# EAGLE board MGBC-MBL-01_2_1 (EAGLE 9.6.2)
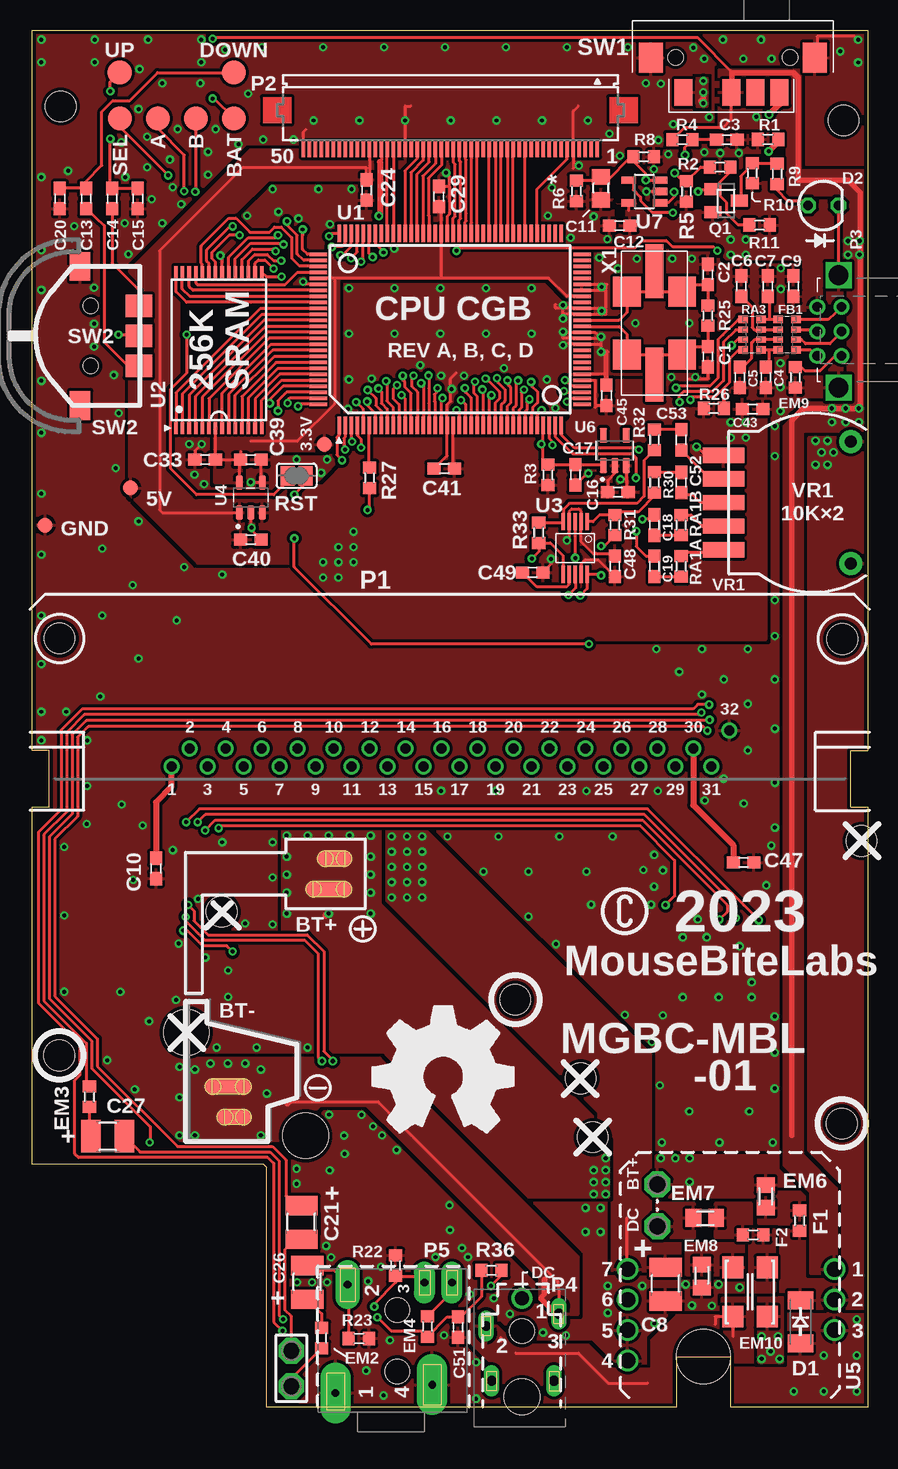
[diagram p1: board, top side]
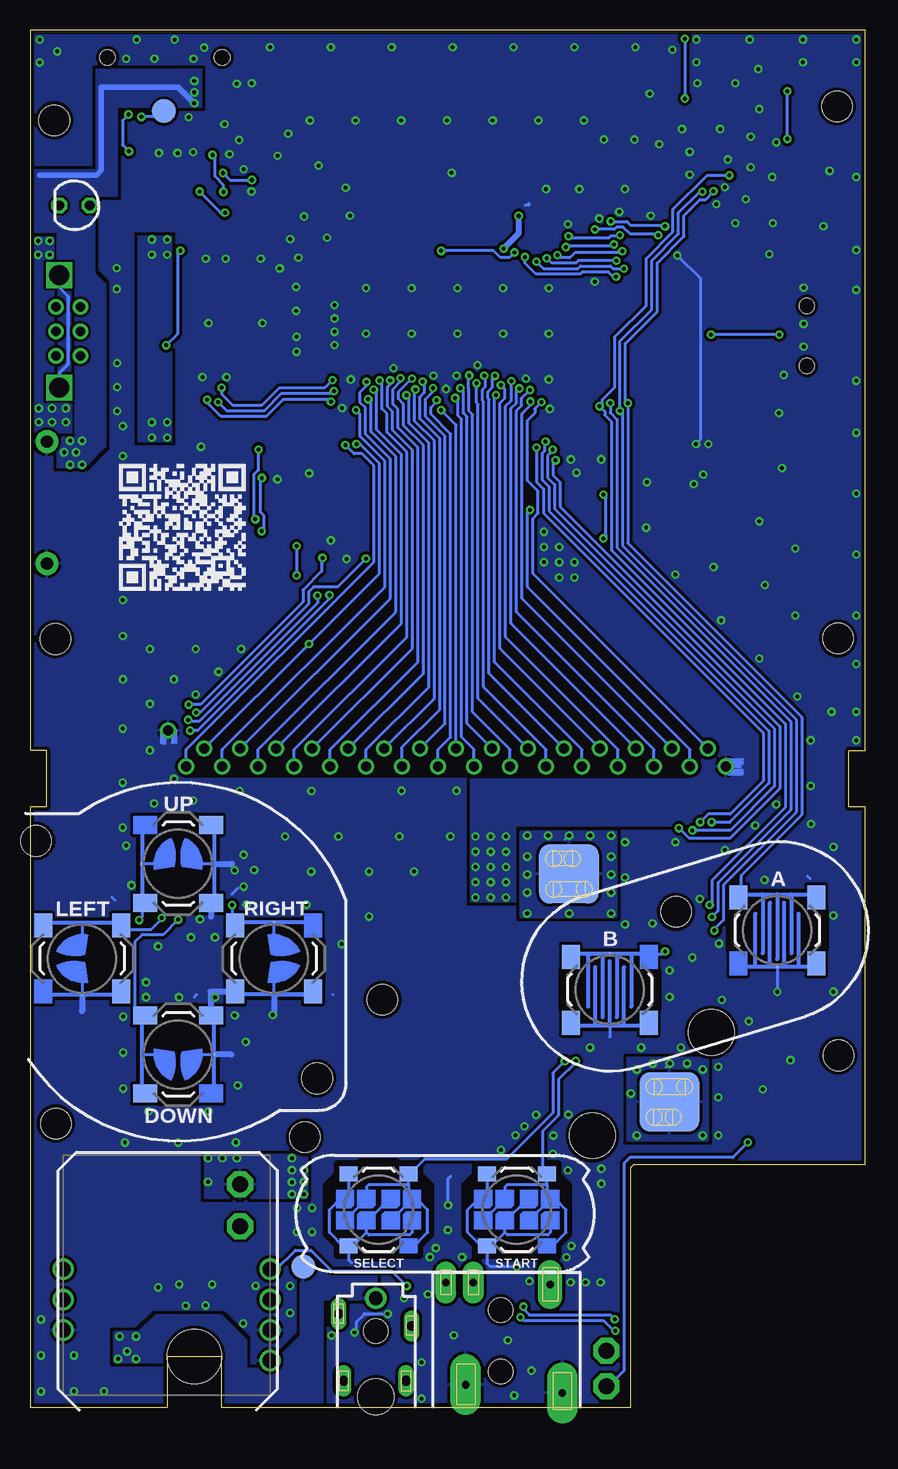
[diagram p2: board, bottom side, seen from below]

Size 69.65 x 114.8 mm. Coordinates in mm from the lower left corner, seen from the top.
Outline: 0,54.75 0,114.8 69.65,114.8 69.65,54.73 68.24,54.73 68.24,50.03 69.65,50.03 69.65,0 58.2,0 58.2,4.19 53.7,4.19 53.7,0 19.55,0 19.55,20 19.3,20.25 0,20.25 0,50.05 1.4,50.05 1.4,54.75 0,54.75
Copper layers (1*16): Top 0.0356mm / dielectric 1.5011mm / Bottom 0.0356mm
Design rules "jlcpcb *": minimum track width 10mil, minimum drill 13mil, track to track 8mil, track to pad 8mil, pad to pad 7mil, via to via 8mil, smd to smd 5mil, copper to edge 12mil, drill to drill 22mil, minimum pad ring 10mil, minimum via ring 7mil, stop-mask expansion 2.5mil, vias tented up to drill 14mil, thermal gap 10mil
Holes 2.54 mm at 2.36,108.43 67.63,107.27 2.27,64.08 67.54,64.03 2.24,29.33 67.5,23.64 40.27,33.97 45.71,27.4 46.73,22.5 15.79,41.29 69.14,47.19
Holes 3.81 mm at 12.84,31.23 22.77,22.63
Holes 4.5 mm at 55.95,4.22
tRestrict: area 24.6,-0.8 to 27.7,-0.1; area 45.5,88.8 to 46.2,91.6; area 22.5,14.3 to 23.7,16.2; area 23.8,-1.8 to 35.8,-0.1; area 46.7,21.5 to 48,22.4; area 55.4,100.2 to 57.1,100.8; area 48.9,99.5 to 49.1,99.9; area 48.9,100.7 to 49.8,101
bRestrict: area 24.6,-0.8 to 27.7,-0.1; area 32.8,52.9 to 56.3,53.8; area 23.8,-1.8 to 35.8,0; area 3.7,42.8 to 4,43.2; area 17.4,31.2 to 18.3,32.2; area 45.5,33.8 to 46.4,34.9; area 53.7,48.3 to 54.8,49.2; area 45.4,33.8 to 45.6,35.8

## Footprints (pad centres in the part's own frame; a part is rotated, then mirrored left to right if it is on the bottom)
B1,27 = smd 1.27 x 1.27: TP 0,0
MGB+BATTERY4 = smd 4.953 x 4.953 bottom: P$1 0.5,0 | smd 2.959 x 1.397: P$2 0.997,1.27 | smd 3.937 x 1.397: P$3 0.514,-1.27
MGB-BATTERY4 = smd 4.953 x 4.953 bottom: P$1 0.25,0.117 | smd 2.959 x 1.397: P$3 0.743,-1.143 | smd 3.937 x 1.397: P$4 0.26,1.397
DMG_BTN3 = smd 1.5 x 2: P$1 -3.25,2.75; P$3 3.25,2.75; P$4 3.25,-2.75 | smd 0.25 x 0.25: P$2 0,-3
TP20R = smd 2 x 2: TP 0,0
P1-13 = drill 1.321 pad 2.159 octagon: TP 0,0
C0603 = smd 1.1 x 1: 1 -0.85,0; 2 0.85,0
C1210 = smd 1.6 x 2.7: 1 -1.4,0; 2 1.4,0
C0805 = smd 1.3 x 1.5: 1 -0.95,0; 2 0.95,0
SOD-123_MINI-SMA = smd 1.5 x 2.1: A 1.8,0; C -1.8,0
LED3MM = drill 0.813 octagon: A -1.27,0; K 1.27,0
MGB_BTN1_2 = smd 1.5 x 2: P$1 -3.25,2.75; P$3 3.25,2.75; P$4 3.25,-2.75 | smd 0.25 x 0.25: P$2 0,-3
R0603 = smd 1 x 1.1: 1 -0.85,0; 2 0.85,0
R0805 = smd 1.3 x 1.5: 1 -0.95,0; 2 0.95,0
ACM4532 = smd 1.8 x 1.75: 1 -2.05,1.425; 2 -2.05,-1.425; 3 2.05,-1.425; 4 2.05,1.425
EXB38V = smd 0.6 x 0.8: 1 -1.275,-0.75; 4 1.275,-0.75; 5 1.275,0.75; 8 -1.275,0.75 | smd 0.5 x 0.8: 2 -0.4,-0.75; 3 0.4,-0.75; 6 0.4,0.75; 7 -0.4,0.75
MGB-CART = drill 0.83: 1 0,0; 2 1.5,1.5; 3 3,0; 4 4.5,1.5; 5 6,0; 6 7.5,1.5; 7 9,0; 8 10.5,1.5; 9 12,0; 10 13.5,1.5; 11 15,0; 12 16.5,1.5; 13 18,0; 14 19.5,1.5; 15 21,0; 16 22.5,1.5; 17 24,0; 18 25.5,1.5; 19 27,0; 20 28.5,1.5; 21 30,0; 22 31.5,1.5; 23 33,0; 24 34.5,1.5; 25 36,0; 26 37.5,1.5; 27 39,0; 28 40.5,1.5; 29 42,0; 30 43.5,1.5; 31 45,0; 32 46.5,3
62684-502100AHLF = smd 0.3 x 1.3: 1 -12.25,3.25; 2 -11.75,3.25; 3 -11.25,3.25; 4 -10.75,3.25; 5 -10.25,3.25; 6 -9.75,3.25; 7 -9.25,3.25; 8 -8.75,3.25; 9 -8.25,3.25; 10 -7.75,3.25; 11 -7.25,3.25; 12 -6.75,3.25; 13 -6.25,3.25; 14 -5.75,3.25; 15 -5.25,3.25; 16 -4.75,3.25; 17 -4.25,3.25; 18 -3.75,3.25; 19 -3.25,3.25; 20 -2.75,3.25; 21 -2.25,3.25; 22 -1.75,3.25; 23 -1.25,3.25; 24 -0.75,3.25; 25 -0.25,3.25; 26 0.25,3.25; 27 0.75,3.25; 28 1.25,3.25; 29 1.75,3.25; 30 2.25,3.25; 31 2.75,3.25; 32 3.25,3.25; 33 3.75,3.25; 34 4.25,3.25; 35 4.75,3.25; 36 5.25,3.25; 37 5.75,3.25; 38 6.25,3.25; 39 6.75,3.25; 40 7.25,3.25; 41 7.75,3.25; 42 8.25,3.25; 43 8.75,3.25; 44 9.25,3.25; 45 9.75,3.25; 46 10.25,3.25; 47 10.75,3.25; 48 11.25,3.25; 49 11.75,3.25; 50 12.25,3.25
CGB-LINK = drill 0.8: +5V 1.909,2.032; CLK -2.159,2.032; GND -2.159,0; IN -0.125,2.032; OUT 1.909,0; SD -0.125,0 | drill 1.651 pad 1.905 square: P$7 -4.822,0.254; P$10 4.572,0.254
MGB-PWRJACK = drill 1.143 pad 1.778: 1 -3.629,-2.005 | drill 0.8 pad 1.3 long: 2 -6.604,-4.314; 3 -0.539,-3.302; 4 -6.15,-8.89; 5 -0.953,-8.89 | hole 3: -3.619,-10.222 | hole 2.032: -3.619,-4.753
MGB-HEADPHONE = drill 0.635 pad 2.54 long: GND -4.644,-4.246; SWGND 3.425,-3.556 | drill 0.635 pad 2.032 long: L -3.623,4.779 | drill 0.635 pad 1.75 long: R 2.79,4.949; SW 5.08,4.949 | hole 2.032: 0.508,2.676; 0.508,-2.442
SOT23 = smd 1 x 1.4: 1 -0.95,-1.1; 2 0.95,-1.1; 3 0,1.1
SJ = smd 1.168 x 1.6: 1 -0.762,0; 2 0.762,0
DMG_BTN1_W2 = smd 1.25 x 1.5: P$1 -3,2.5; P$3 3,2.5; P$4 3,-2.5 | smd 0.05 x 0.05: P$2 0,-4.07
MGB-SWITCH = smd 1.5 x 2.2: P$1 -3.75,-2.141; P$2 2.25,-2.141; P$3 4.25,-2.141; P$C 0.25,-2.141 | smd 2 x 2.5: P$MP1 -6.48,0.759; P$MP2 7.22,0.759 | hole 1.3: -4.4,0.759; 5.15,0.759
NAV_SWITCH = smd 1.9 x 2.2: 1 -2.5,-4; 2 2.5,-4; T 0,-4 | smd 2.4 x 1.7: C 5.8,0.9; NC -5.8,0.9 | hole 1.25: -2.5,0; 2.5,0
QFP-128 = smd 0.3 x 1.45: 1 -8.25,-4.5; 2 -7.75,-4.5; 3 -7.25,-4.5; 4 -6.75,-4.5; 5 -6.25,-4.5; 6 -5.75,-4.5; 7 -5.25,-4.5; 8 -4.75,-4.5; 9 -4.25,-4.5; 10 -3.75,-4.5; 11 -3.25,-4.5; 12 -2.75,-4.5; 13 -2.25,-4.5; 14 -1.75,-4.5; 15 -1.25,-4.5; 16 -0.75,-4.5; 17 -0.25,-4.5; 18 0.25,-4.5; 19 0.75,-4.5; 20 1.25,-4.5; 21 1.75,-4.5; 22 2.25,-4.5; 23 2.75,-4.5; 24 3.25,-4.5; 25 3.75,-4.5; 26 4.25,-4.5; 27 4.75,-4.5; 28 5.25,-4.5; 29 5.75,-4.5; 30 6.25,-4.5; 31 6.75,-4.5; 32 7.25,-4.5; 33 7.75,-4.5; 34 8.25,-4.5; 35 8.75,-4.5; 36 9.25,-4.5; 37 9.75,-4.5; 38 10.25,-4.5; 65 10.25,11.5; 66 9.75,11.5; 67 9.25,11.5; 68 8.75,11.5; 69 8.25,11.5; 70 7.75,11.5; 71 7.25,11.5; 72 6.75,11.5; 73 6.25,11.5; 74 5.75,11.5; 75 5.25,11.5; 76 4.75,11.5; 77 4.25,11.5; 78 3.75,11.5; 79 3.25,11.5; 80 2.75,11.5; 81 2.25,11.5; 82 1.75,11.5; 83 1.25,11.5; 84 0.75,11.5; 85 0.25,11.5; 86 -0.25,11.5; 87 -0.75,11.5; 88 -1.25,11.5; 89 -1.75,11.5; 90 -2.25,11.5; 91 -2.75,11.5; 92 -3.25,11.5; 93 -3.75,11.5; 94 -4.25,11.5; 95 -4.75,11.5; 96 -5.25,11.5; 97 -5.75,11.5; 98 -6.25,11.5; 99 -6.75,11.5; 100 -7.25,11.5; 101 -7.75,11.5; 102 -8.25,11.5 | smd 1.45 x 0.3: 39 12,-2.75; 40 12,-2.25; 41 12,-1.75; 42 12,-1.25; 43 12,-0.75; 44 12,-0.25; 45 12,0.25; 46 12,0.75; 47 12,1.25; 48 12,1.75; 49 12,2.25; 50 12,2.75; 51 12,3.25; 52 12,3.75; 53 12,4.25; 54 12,4.75; 55 12,5.25; 56 12,5.75; 57 12,6.25; 58 12,6.75; 59 12,7.25; 60 12,7.75; 61 12,8.25; 62 12,8.75; 63 12,9.25; 64 12,9.75; 103 -10,9.75; 104 -10,9.25; 105 -10,8.75; 106 -10,8.25; 107 -10,7.75; 108 -10,7.25; 109 -10,6.75; 110 -10,6.25; 111 -10,5.75; 112 -10,5.25; 113 -10,4.75; 114 -10,4.25; 115 -10,3.75; 116 -10,3.25; 117 -10,2.75; 118 -10,2.25; 119 -10,1.75; 120 -10,1.25; 121 -10,0.75; 122 -10,0.25; 123 -10,-0.25; 124 -10,-0.75; 125 -10,-1.25; 126 -10,-1.75; 127 -10,-2.25; 128 -10,-2.75
TSOP1-28 = smd 1 x 0.3: 1 -6.5,3.575; 2 -6.5,3.025; 3 -6.5,2.475; 4 -6.5,1.925; 5 -6.5,1.375; 6 -6.5,0.825; 7 -6.5,0.275; 8 -6.5,-0.275; 9 -6.5,-0.825; 10 -6.5,-1.375; 11 -6.5,-1.925; 12 -6.5,-2.475; 13 -6.5,-3.025; 14 -6.5,-3.575; 15 6.5,-3.575; 16 6.5,-3.025; 17 6.5,-2.475; 18 6.5,-1.925; 19 6.5,-1.375; 20 6.5,-0.825; 21 6.5,-0.275; 22 6.5,0.275; 23 6.5,0.825; 24 6.5,1.375; 25 6.5,1.925; 26 6.5,2.475; 27 6.5,3.025; 28 6.5,3.575
VSSOP10 = smd 1.45 x 0.3: 1 -2.2,0.985; 2 -2.2,0.485; 3 -2.2,-0.015; 4 -2.2,-0.515; 5 -2.2,-1.015; 6 2.2,-1.015; 7 2.2,-0.515; 8 2.2,-0.015; 9 2.2,0.485; 10 2.2,0.985
SOT95P280X145-5N = smd 1.21 x 0.59: 1 -1.255,0.95; 2 -1.255,0; 3 -1.255,-0.95; 4 1.255,-0.95; 5 1.255,0.95
MGB-PWRBD = drill 1.27: 1 -0.25,10.5; 2 -0.25,7.96; 3 -0.25,5.42; 4 17,2.88; 5 17,5.42; 6 17,7.96; 7 17,10.5
SOT-23-5 = smd 1.21 x 0.59: 1 -1.255,0.95; 2 -1.255,0; 3 -1.255,-0.95; 4 1.255,-0.95; 5 1.255,0.95
DBV-R-PDSO-G5 = smd 0.6 x 1.2: 1 -0.95,-1.306; 2 0,-1.306; 3 0.95,-1.306; 4 0.95,1.306; 5 -0.95,1.306
MGB-POT = smd 1.27 x 3.429: P$1 -3.937,-5.524; P$2 -1.968,-5.524; P$3 0,-5.524; P$4 1.968,-5.524; P$5 3.937,-5.524 | drill 1.016 pad 1.905: P$6 -5.08,5.08; P$7 5.08,5.08
7.5X5-4-PAD = smd 2.3 x 2.5: 1 2.3,-2.625; 2 2.3,2.625; 3 -2.3,2.625; 4 -2.3,-2.625 | smd 1.5 x 4.5: 5 0,-4.275; 6 0,4.325

## Placement (x,y rotation side)
3.3V  PTR1B1,27  [B1,27]  24.35,80.26 0 top
5V  PTR1B1,27  [B1,27]  8.18,76.62 0 top
+  MGB+BATTERY4  [MGB+BATTERY4]  24.21,44.46 0 top
-  MGB-BATTERY4  [MGB-BATTERY4]  16.08,25.33 0 top
A  DMG-BTN  [DMG_BTN3]  7.36,39.74 0 bottom
B  DMG-BTN  [DMG_BTN3]  21.31,34.79 180 bottom
BATT  PTR1TP20R  [TP20R]  16.82,107.43 0 top
BRIGHTNESS  PTR1TP20R  [TP20R]  16.79,111.24 0 top
BT+  TPPAD1-13  [P1-13]  52.12,18.57 0 top
C1  18pF  [C0603]  56.31,87.56 270 top
C2  27pF  [C0603]  56.31,94.42 90 top
C3  100n  [C0603]  57.9,105.66 0 top
C4  22pF  [C0603]  61.15,85.84 270 top
C5  100pF  [C0603]  58.99,85.84 270 top
C6  100pF  [C0603]  59.11,93.44 90 top
C7  100pF  [C0603]  61.32,93.44 90 top
C8  100uF  [C1210]  52.8,10.25 270 top
C9  0.01uF  [C0603]  63.46,93.44 90 top
C10  0.01uF  [C0603]  10.3,44.9 270 top
C11  22u  [C0805]  47.42,101.6 270 top
C12  100n  [C0603]  48.96,98.5 180 top
C13  100pF  [C0603]  4.47,100.75 270 top
C14  100pF  [C0603]  6.64,100.75 270 top
C15  27pF  [C0603]  8.8,100.75 270 top
C16  1uF  [C0603]  48.82,76.29 0 top
C17  1uF  [C0603]  45.27,77.72 270 top
C18  1uF  [C0603]  51.87,73.53 270 top
C19  1uF  [C0603]  51.87,70.1 270 top
C20  27pF  [C0603]  2.3,100.75 270 top
C21  100uF  [C1210]  22.44,15.39 90 top
C24  0.1uF  [C0603]  27.87,101.46 270 top
C26  100uF  [C1210]  22.92,10.4 90 top
C27  100uF  [C1210]  6.28,22.58 0 top
C29  0.01uF  [C0603]  33.88,100.91 90 top
C33  0.01uF  [C0603]  14.41,78.99 180 top
C39  1uF  [C0603]  18.21,78.99 0 top
C40  1uF  [C0603]  18.21,72.32 0 top
C41  0.01uF  [C0603]  34.34,78.22 180 top
C43  0.1uF  [C0603]  60.05,83.21 0 top
C45  0.01uF  [C0603]  47.88,84.34 90 top
C47  150pF  [C0603]  59.29,45.4 0 top
C48  1uF  [C0603]  48.57,70.1 90 top
C49  1uF  [C0603]  41.71,69.59 0 top
C51  1uF  [C0603]  35.49,6.67 270 top
C52  100nF  [C0603]  54.09,77.08 90 top
C53  100nF  [C0603]  54.09,80.64 90 top
D1  CGRM4001-G  [SOD-123_MINI-SMA]  64.05,7.12 270 top
D2  [LED3MM]  65.94,100.17 0 top
DC  TPPAD1-13  [P1-13]  52.12,15.07 0 top
DC_IN  TPTP20R  [TP20R]  46.88,11.72 0 bottom
DOWN  DMG-BTN  [MGB_BTN1_2]  57.3,29.4 90 bottom
EM2  BLM18BD102SN1D  [R0603]  24.12,5.76 90 top
EM3  BLM18BD102SN1D  [R0603]  4.75,25.87 270 top
EM4  BLM18BD102SN1D  [R0603]  32.95,6.73 90 top
EM6  Z0805C221BPWZT  [R0805]  61.13,17.57 270 top
EM7  Z0805C221BPWZT  [R0805]  56.07,15.76 180 top
EM8  Z0805C221BPWZT  [R0805]  55.83,10.92 270 top
EM9  BLM18BD102SN1D  [R0603]  63.62,85.84 270 top
EM10  [ACM4532]  59.84,9.6 270 top
F1  1A  [R0603]  63.97,15.54 270 top
F2  1A  [R0603]  60.11,14.35 180 top
FB1  BLA31AG601SN4D  [EXB38V]  62.92,89.4 90 top
GND  PTR1B1,27  [B1,27]  1.07,73.53 0 top
LEFT  DMG-BTN  [MGB_BTN1_2]  65.3,37.4 0 bottom
OSD_A  PTR1TP20R  [TP20R]  10.47,107.43 0 top
OSD_B  PTR1TP20R  [TP20R]  13.64,107.43 0 top
OSD_SEL  PTR1TP20R  [TP20R]  7.29,107.43 0 top
P1  MGB-CART  [MGB-CART]  11.61,53.4 0 top
P2  GBC_LCDH  [62684-502100AHLF]  34.85,108.11 180 top
P3  LINKPORTDMG-LINK-SHORT  [CGB-LINK]  67.48,89.8 90 top
P4  MGB-PWRJACK  [MGB-PWRJACK]  44.44,11.08 0 top
P5  MGBHPMGB  [MGB-HEADPHONE]  29.9,5.42 0 top
PALETTE  PTR1TP20R  [TP20R]  7.28,111.24 0 top
Q1  BSS84  [SOT23]  57.84,100.58 270 top
R1  1k  [R0603]  61.33,105.68 180 top
R2  1.5M  [R0603]  57.33,103.37 180 top
R3  18k  [R0603]  42.98,77.72 90 top
R4  100k  [R0603]  54.2,105.66 180 top
R5  100k  [R0603]  54.54,101.34 270 top
R6  124k  [R0603]  45.36,101.38 90 top
R8  249k  [R0603]  50.98,104.23 180 top
R9  18k  [R0603]  62.1,102.8 270 top
R10  100k  [R0603]  60.02,102.86 90 top
R11  18k  [R0603]  60.63,98.54 180 top
R22  1k  [R0603]  30.28,11.8 90 top
R23  1k  [R0603]  27.23,5.72 0 top
R25  1.5M  [R0603]  56.31,90.99 90 top
R26  5.6k  [R0603]  56.82,83.26 180 top
R27  100  [R0603]  28.12,77.46 270 top
R30  100k  [R0603]  51.87,77.08 90 top
R31  18k  [R0603]  48.57,73.53 90 top
R32  100k  [R0603]  51.87,80.64 90 top
R33  18k  [R0603]  42.22,72.89 90 top
R36  100k  [R0603]  38.28,11.41 0 top
RA1A  510  [R0603]  54.09,70.1 270 top
RA1B  510  [R0603]  54.09,73.53 270 top
RA3  270  [EXB38V]  60,89.4 90 top
RIGHT  DMG-BTN  [MGB_BTN1_2]  49.3,37.4 180 bottom
RST  [SJ]  22.03,77.64 180 top
SELECT  DMG-BTN  [DMG_BTN1_W2]  40.59,16.46 90 bottom
SPK+  PTR1PAD1-13  [P1-13]  21.59,4.69 0 top
SPK-  PTR1PAD1-13  [P1-13]  21.59,1.75 0 top
START  DMG-BTN  [DMG_BTN1_W2]  29.06,16.46 90 bottom
SW  TPTP20R  [TP20R]  58.5,108.05 0 bottom
SW1  MGB-SW1  [MGB-SWITCH]  58.03,111.75 0 top
SW2  NAV_SWITCH  [NAV_SWITCH]  4.87,89.3 90 top
U1  GBC_CPU  [QFP-128]  33.84,86.35 0 top
U2  LH52256CVTXIZ  [TSOP1-28]  15.55,88.13 90 top
U3  LM4853  [VSSOP10]  45.27,71.62 270 top
U4  TLV70233QDBVRQ1  [SOT95P280X145-5N]  18.21,75.81 90 top
U5  MGB-PWR_BD  [MGB-PWRBD]  66.63,1 0 bottom
U6  TPS3840  [SOT-23-5]  48.57,79.75 90 top
U7  TL331  [DBV-R-PDSO-G5]  51.03,101.34 90 top
UP  DMG-BTN  [MGB_BTN1_2]  57.3,45.3 270 bottom
VR1  [MGB-POT]  63.16,75.41 270 top
X1  8.388608MHZ12SMX-B-4-PAD  [7.5X5-4-PAD]  51.87,90.35 0 top

## Tracks (layer width: path | path; a pad name or v marks a point on that pad's centre or on a via)
!CS1
  Top 0.254: U1.110 23.82,92.58 22.97,92.58 13.15,92.58 12.51,93.22 12.51,94.61 U2.27
!MRD
  Top 0.254: U1.112 23.82,91.58 18.99,91.58 11.97,84.57 U2.1
!MWR
  Top 0.254: U1.117 19.74,89.1 14.72,84.08 U2.6
+3V3  (via drill 0.35)
  Top 0.254: U2.7 15.26,81.51 C33.1 17.16,78.99 17.27,78.89 | 34.09,94.13 U1.85 34.09,99.85 C29.1 | 25.2,94.1 34.09,94.1 34.09,94.13 | 25.2,94.1 U1.107 | U1.57 44.57,92.6 43.04,94.13 34.09,94.13 | U4.5 17.27,78.89 | 17.27,78.89 C39.1 17.37,79.66 | 18.21,80.51 22.09,80.51 25.2,83.62 25.2,94.1 | P2.37 29.1,103.93 28.98,103.8
  Top 0.5: 28.98,103.8 28.98,99.33 28.96,99.36 v28.9,99.3
  Bottom 0.5: v28.9,99.3 28.91,99.12 28.91,97.82 v30.16,96.57
  pour Top: 33.45,100.83 33.45,97.66 24.57,97.66 24.57,85.59 15.17,85.59 15.17,77.08 17.45,77.08 17.45,79.75 25.58,79.75 25.58,94.1 42.98,94.1 44.5,92.58 46.41,92.58 46.41,92.96 45.27,92.96 45.27,96.64 36.88,96.64 35.99,97.53 35.99,100.83
+5V  (via drill 0.33)
  Top 0.254: C48.1 47.21,70.6 46.09,70.6 45.75,70.26 U3.9 | U6.2 48.57,77.84 47.97,77.25 C16.1 | C45.1 47.06,83.49 46.91,83.34 46.91,85.6 U1.43 | C41.1 35.09,78.33 U1.20 | P2.39 28.1,102.54 C24.1 27.87,103.31 17.52,103.31 10.6,96.39 10.6,74.8 10.83,74.56 U4.1 | 49.72,99.78 U7.5 | 39.13,11.37 R36.2 39.13,10.99 v38.24,10.1 | 49.54,11.58 U5.7 49.55,11.58 49.55,15.75
  Top 0.508: C10.1 10.3,50.41 11.61,51.72 P1.1
  Bottom 0.254: 11.61,53.46 P1.1 10.4,53.4 | v38.24,10.1 39.5,11.36 44.5,11.36 46.22,13.09 47.52,13.09 49.12,11.5 U5.7 | 11.46,53.65 10.25,53.65 | 11.46,53.8 10.25,53.8 | 11.46,54 10.25,54 | 11.46,53.1 10.25,53.1 | 11.46,52.9 10.25,52.9 | 11.46,52.8 10.25,52.8
  other vias: 29.96,42.49 31.23,42.49 32.5,42.49 32.5,43.76 31.23,43.76 29.96,43.76 29.96,45.03 31.23,45.03 32.5,45.03 29.96,46.3 29.96,47.57 31.23,47.57 32.5,47.57 32.5,46.3 31.23,46.3 26.79,72.97 26.79,71.7 26.79,70.43 25.52,69.16 25.52,70.43 25.52,71.7 24.25,70.43 24.25,69.16 58.22,80.83 59.49,82.1 58.22,82.1 59.49,80.83 58.22,97.34 59.49,97.34 59.49,96.07 58.22,96.07
  pour Bottom (isolate 0.254): 8.37,53.33 11.87,53.33 11.87,54.09 27.74,69.97 27.74,76.06 8.37,56.7
  pour Top (isolate 0.254, rank 5): 48.31,11.38 54.3,11.38 54.3,13.62 51.55,13.62 51.55,29.39 32.82,48.12 29.51,48.12 29.51,41.48 48.31,22.68
  pour Bottom (isolate 0.254): 8.69,55.74 8.69,51.94 12.14,48.49 29.24,48.49 29.24,42.15 32.82,42.15 32.82,52.33 14.64,52.33 13.77,53.2 13.77,53.84 11.87,55.74
  pour Top (isolate 0.254, rank 3): 15.68,79.24 15.68,70.35 22.03,70.35 28.38,64 61.19,64 61.19,82.42 59.65,82.42 59.65,84 53.28,84 51.7,85.59 44.88,85.59 44.88,82.42 44.25,81.78 25.84,81.78 25.84,79.24
  pour Top (isolate 0.254): 29.64,104.78 18.12,104.78 8.06,94.72 8.06,76.06 13.77,70.35 17.58,70.35 17.58,76.06 13.77,76.06 12.23,77.61 12.23,93.17 13.77,94.72 13.77,97.02 16.31,99.56 16.95,99.56 19.72,102.34 29.64,102.34
  pour Top (isolate 0.254, rank 3): 48.7,102.09 48.7,97.02 49.09,96.62 56.95,96.62 57.82,95.75 64.57,95.75 64.89,95.43 67.48,95.43 67.48,102.09
  pour Top (isolate 0.254): 65.8,95.75 65.8,91.38 63.37,91.38 63.37,92.58 64.31,92.58 64.31,95.75
  pour Bottom (isolate 0.254): 60.56,80.51 60.56,97.58 57.9,97.58 57.9,80.51
A0  (via drill 0.33)
  Top 0.254: U1.9 29.59,83.21 29.11,83.69 29.11,84.66 v28.85,84.92
  Bottom 0.254: P1.6 29.54,65.32 29.54,83.26 29.11,83.69 29.11,84.66 v28.85,84.92
A1  (via drill 0.33)
  Top 0.254: U1.10 30.09,83.36 29.56,83.88 29.56,85.46 v29.5,85.53
  Bottom 0.254: P1.7 20.61,54.81 30,64.19 30,83.45 29.56,83.88 29.56,85.46 v29.5,85.53
A2  (via drill 0.33)
  Top 0.254: v30.4,85.19 30.08,84.88 30.08,84.08 30.59,83.58 U1.11
  Bottom 0.254: P1.8 30.45,63.24 30.45,83.71 30.08,84.08 30.08,84.88 v30.4,85.19
A3  (via drill 0.33)
  Top 0.254: v30.79,84.37 31.09,84.07 U1.12
  Bottom 0.254: P1.9 23.61,54.81 30.91,62.11 30.91,84.24 v30.79,84.37
A4  (via drill 0.33)
  Top 0.254: v30.88,85.97 30.88,85.66 31.07,85.47 31.07,85.04 31.59,84.52 U1.13
  Bottom 0.254: P1.10 31.37,61.15 31.37,83.99 31.46,84.09 31.46,84.64 31.07,85.04 31.07,85.79 v30.89,85.97 v30.88,85.97
A5  (via drill 0.33)
  Top 0.254: U1.14 32.11,81.87 32.11,84.65 31.67,85.08 31.67,85.89 v31.77,85.99
  Bottom 0.254: P1.11 26.61,54.81 31.82,60.02 31.82,83.81 31.92,83.9 31.92,84.83 31.67,85.08 31.67,85.89 v31.77,85.99
A6  (via drill 0.33)
  Top 0.254: v32.42,85.35 32.61,85.17 32.61,81.87 U1.15
  Bottom 0.254: P1.12 32.28,59.07 32.28,83.6 32.42,83.75 v32.42,85.35
A7  (via drill 0.33)
  Top 0.254: 33.09,84.9 33.1,84.91 33.1,84.95 | 33.1,84.95 33.1,85.93 v33.03,86 | U1.16 33.09,83.65 33.07,83.66 33.07,84.93 33.1,84.95
  Bottom 0.254: P1.13 29.61,54.81 32.74,57.94 32.74,82.73 33.05,83.05 33.05,84.87 33.1,84.91 33.1,85.93 v33.03,86
A8  (via drill 0.33)
  Top 0.254: 33.61,81.87 U1.17 33.59,83.79 33.53,83.85 33.53,84.41 33.77,84.65 v33.77,84.95 33.59,84.77
  Bottom 0.254: P1.14 33.2,56.98 33.2,82.55 33.51,82.86 33.51,84.69 v33.77,84.95
A9  (via drill 0.33)
  Top 0.254: 34.11,81.87 U1.18 34.09,84.01 v34.2,84.13
  Bottom 0.254: P1.15 32.61,54.81 33.65,55.85 33.65,82.36 33.97,82.67 33.97,83.89 v34.2,84.13
A10  (via drill 0.33)
  Top 0.254: v35.36,83.12 35.59,82.9 U1.21
  Bottom 0.254: P1.16 34.11,81.87 v35.36,83.12
A11  (via drill 0.33)
  Top 0.254: U1.22 36.09,82.83 36.1,82.84 36.1,83.59 v35.74,83.95
  Bottom 0.254: P1.17 35.61,54.81 34.57,55.85 34.57,81.12 36.22,82.78 36.22,83.34 35.74,83.82 v35.74,83.95
A12  (via drill 0.33)
  Top 0.254: v36.06,84.95 36.06,84.65 36.57,84.14 36.57,81.87 U1.23
  Bottom 0.254: P1.18 35.02,56.98 35.02,80.94 36.68,82.59 36.68,84.01 36.06,84.64 v36.06,84.95
A13  (via drill 0.33)
  Top 0.254: v36.91,85.49 36.78,85.36 36.78,84.57 37.07,84.28 37.07,81.87 U1.24
  Bottom 0.254: P1.19 38.61,55.03 35.48,58.16 35.48,80.75 37.14,82.4 37.14,84.2 36.78,84.56 36.78,85.36 v36.91,85.49
A14  (via drill 0.33)
  Top 0.254: v37.52,84.84 37.59,84.77 U1.25
  Bottom 0.254: P1.20 35.94,59.07 35.94,80.56 37.59,82.21 37.59,84.76 v37.52,84.84
A15  (via drill 0.33)
  Top 0.254: v38.27,84.35 38.09,84.17 U1.26
  Bottom 0.254: P1.21 41.61,54.81 36.4,60.02 36.4,80.37 38.05,82.02 38.05,84.13 v38.27,84.35
BATT  (via drill 0.35)
  Top 0.504: 24.46,41.04 24.5,41 24.45,40.95 | 28.06,44.46 28.1,44.5 | 24.76,47.59 v24.7,47.65 | 21.24,44.46 21.2,44.5
  Bottom 0.254: 25.01,47.34 v24.7,47.65
  other vias: 47.8,20.75 47.8,19.75 47.8,18.75 47.8,17.75 46.8,17.75 46.8,18.75 46.8,19.75 54.8,20.75 54.8,18.77 52.39,20.75 53.61,20.75 21.2,47.65 28.2,47.65 28.2,44.4 21.2,44.4 21.2,41.15 28.2,41.15 24.7,41.15 21.2,45.9 28.2,45.9 22.95,47.65 26.45,47.65 21.2,42.9 28.2,42.9
  pour Top (isolate 0.254, rank 4): 20.82,48.12 20.82,39.37 23.3,39.37 23.93,38.73 23.93,29.07 27.74,29.07 39.3,17.51 48.06,17.51 48.06,22.91 29.01,41.95 29.01,48.12
  pour Bottom (isolate 0.25, rank 5): 55.05,21 55.05,17.5 46.55,17.5 46.55,21
  pour Top (isolate 0.25, rank 5): 52.05,21 62.55,21 64.55,19 64.55,17.5 52.05,17.5
  pour Bottom: 20.8,48 20.8,40.85 28.7,40.85 28.7,48
BATT_LVL  (via drill 0.33)
  Top 0.254: R2.1 58.18,102.97 56.81,101.6 56.81,101.47 | R11.2 58.85,98.54 57.9,99.5 57.9,100.39 56.81,101.47 | U7.4 50.1,102.29 50.1,101.47 50.7,100.87 50.7,100.58 51.65,99.63 53.33,99.63 v53.39,99.56 | 56.68,101.47 55.64,101.47 v55.51,101.34 | 56.68,101.47 56.81,101.47 | Q1.1 56.68,101.47
  Bottom 0.254: v53.39,99.56 53.77,99.56 55.51,101.3 v55.51,101.34
BATT_SENSE  (via drill 0.35)
  Top 0.254: C3.1 R4.1 54.42,105.03 v54.42,104.38 | U7.1 52.41,100.46 53.07,100.46 53.52,100.9 v53.52,101.28 v53.51,101.29
  Bottom 0.254: v54.42,104.38 54.23,104.18 54.23,102.61 53.51,101.88 v53.51,101.29
BATT_TH  (via drill 0.35)
  Top 0.254: 52.07,102.29 U7.3 v51.15,102.3 | v53.55,102.89 54.25,102.19 R5.1 55.72,103.37 R2.2 | v51.15,102.3 51.15,102.83 50.13,103.85 R8.2 49.92,104.23 47.86,102.17 47.8,102.17 C11.1 47.1,102.22 R6.2 | v51.15,102.3 51.17,102.3
  Bottom 0.254: v53.55,102.89 v53.55,102.88 52.96,102.3 v51.15,102.3
CK1
  Top 0.254: U1.52 45.86,90.08 48.94,90.08 49.58,89.44 X1.4 51.8,87.73 | 51.8,87.73 X1.1 53.87,87.74 54.54,88.41 C1.1 R25.1 | X1.5 51.8,86.15 51.8,87.73
CK2
  Top 0.254: U1.53 45.86,90.62 48.94,90.62 49.55,91.24 49.57,91.24 X1.3 51.8,92.98 | 51.8,92.98 X1.2 53.95,92.98 54.54,93.57 C2.1 R25.2 | X1.6 51.87,93.05 51.8,92.98
CLK  (via drill 0.33)
  Top 0.254: U1.5 27.59,82.82 27.56,82.84 27.56,83.23 v27.01,83.78
  Bottom 0.254: P1.2 27.71,69.5 27.71,74.08 27.28,74.52 27.28,76.34 28.17,77.23 28.17,82.24 27.56,82.84 27.56,83.23 v27.01,83.78
CS  (via drill 0.33)
  Top 0.254: v27.96,84.79 28.65,84.1 28.65,83.5 29.09,83.07 U1.8
  Bottom 0.254: P1.5 17.61,54.81 29.08,66.28 29.08,83.07 28.65,83.5 28.65,84.1 v27.96,84.79
D0  (via drill 0.33)
  Top 0.254: v37.8,85.73 38.01,85.51 38.06,85.51 38.94,84.64 38.94,84.07 38.59,83.71 U1.27
  Bottom 0.254: P1.22 36.85,61.15 36.85,80.18 38.51,81.83 38.51,83.62 38.94,84.05 38.94,84.64 38.06,85.51 38.01,85.51 v37.8,85.73
D1  (via drill 0.33)
  Top 0.254: v38.74,85.78 38.74,85.48 39.4,84.83 39.4,83.88 39.09,83.57 U1.28
  Bottom 0.254: P1.23 44.61,54.81 37.31,62.11 37.31,79.99 38.97,81.64 38.97,83.18 39.4,83.61 39.4,84.86 38.74,85.51 v38.74,85.78
D2  (via drill 0.33)
  Top 0.254: U1.29 39.59,83.42 39.86,83.69 39.86,85.01 39.62,85.25 v39.62,85.59
  Bottom 0.254: P1.24 37.77,63.24 37.77,79.8 39.42,81.45 39.42,82.99 39.86,83.42 39.86,85.05 39.62,85.29 v39.62,85.59
D3  (via drill 0.33)
  Top 0.254: U1.30 40.09,83.28 40.31,83.5 40.31,85.4 v40.51,85.59
  Bottom 0.254: P1.25 47.61,54.81 38.23,64.19 38.23,79.61 39.88,81.27 39.88,82.8 40.31,83.23 40.31,85.4 v40.51,85.59
D4  (via drill 0.33)
  Top 0.254: v40.99,84.81 40.77,84.6 40.77,83.31 40.59,83.13 U1.31
  Bottom 0.254: P1.26 38.68,65.32 38.68,79.42 40.77,81.51 40.77,84.6 v40.99,84.81
D5  (via drill 0.33)
  Top 0.254: v41.44,84.01 41.23,83.8 41.23,83.12 41.09,82.98 U1.32
  Bottom 0.254: P1.27 50.61,54.81 39.14,66.28 39.14,79.23 41.23,81.32 41.23,83.8 v41.44,84.01
D6  (via drill 0.33)
  Top 0.254: v41.59,85.47 41.59,85.16 42.12,84.63 42.12,83.73 41.71,83.33 41.71,82.97 41.61,82.86 41.61,81.87 U1.33
  Bottom 0.254: P1.28 39.6,67.41 39.6,79.04 41.68,81.13 41.68,83.3 42.12,83.73 42.12,84.62 41.59,85.15 v41.59,85.47
D7  (via drill 0.33)
  Top 0.254: v42.46,83.12 42.4,83.07 | 42.4,83.07 42.38,83.07 42.38,82.99 42.11,82.71 42.11,81.87 U1.34 42.09,82.16 42.11,82.18 42.11,82.42 | 42.4,83.07 42.41,83.07
  Bottom 0.254: P1.29 53.61,54.81 40.05,68.36 40.05,78.85 42.14,80.94 42.14,82.81 v42.46,83.12
DCK
  Top 0.254: U1.94 29.59,104.85 P2.36
ELP2
  Top 0.254: P3.OUT 66.36,90.67 FB1.4
ELP3
  Top 0.254: P3.IN 65.24,89.8 FB1.3
ELP4
  Top 0.254: FB1.2 64.12,89 64.49,88.64 66.5,88.64 P3.SD
ELP5
  Top 0.254: P3.CLK 65.42,87.58 64.88,88.12 FB1.1
EM10_GND
  Top 0.254: 51.3,2 48.05,2 45.55,4.5 40.3,4.5 | 39.05,5.81 39.05,5.5 | 58.42,5.88 EM10.3 56.94,7.55 56.94,6.9
  pour Top (isolate 0.25): 36.55,7.75 36.55,5.4 39.3,2.65 39.3,0 43.8,0 43.8,0.25 55.8,0.25 55.8,3.3 54.6,3.3 54.45,3.15 48.4,3.15 46.4,5.15 40.4,5.15 38.3,7.25 38.3,7.75
  pour Top (isolate 0.25, rank 5): 57.55,9.12 60.3,9.12 60.3,3.75 57.55,3.75
  pour Top: 51.67,0 51.67,5.62 53.72,7.67 58.8,7.67 58.8,6.88 57.8,6.88 53.67,2.75 53.67,0
EM10_POS  (via drill 0.35)
  other vias: 60.8,5.9 62.17,5.9 62.3,4.03 60.8,4.03 61.55,4.65
  pour Bottom (isolate 0.254): 40.8,11.29 40.8,9 45.3,9 45.3,0.25 53.6,0.25 53.6,3.18 49.83,3.18 47.02,5.99 47.02,11.29
  pour Top (isolate 0.25, rank 4): 60.52,9.12 60.52,3.75 62.58,3.75 62.58,9.12
  pour Bottom: 53.67,0.12 53.67,3.75 62.58,3.75 62.58,6.28 60.52,6.28 59.12,7.67 53.72,7.67 51.67,5.62 51.67,0.12
GND  (via drill 0.33, 0.35)
  Top 0.254: C48.2 48.4,71.11 46.79,71.11 45.75,72.15 45.75,73.53 | 45.75,73.53 U3.2 | 45.75,73.53 45.73,73.55 45.73,74.68 45.54,74.88 44.96,74.88 44.77,74.68 44.77,73.84 U3.4 44.75,72.25 v44.57,72.25 | U6.3 49.52,77.33 | 49.52,77.33 49.52,76.45 C16.2 | C45.2 47.88,86.1 U1.44 | C41.2 34.59,79.32 U1.19 34.59,83.56 34.87,83.85 34.87,85.74 35.36,86.22 | U2.21 15.82,95.86 v15.68,96 | v14.12,80.29 13.56,79.73 C33.2 | U7.2 v51.19,101.34 | U1.108 22.78,93.6 v22.57,93.81 | C3.2 58.98,105.66 | 58.9,104.51 v58.9,104.55 | R8.1 51.83,104.52 | SW1.P$MP2 65.43,112.68 65.43,114.28 68.57,114.28 v68.85,114 | P2.33 31.1,108.45 31.55,108.45 | C24.2 28.06,100.42 28.06,100.35 | U1.59 47.82,93.6 | 47.82,93.6 47.92,93.6 47.92,93.61 | U1.58 47.82,93.1 | 47.82,93.1 47.82,93.6 | 47.82,91.6 U1.55 44.25,91.6 | 47.82,91.6 47.82,93.1 | 47.82,91.6 47.82,91.1 U1.54 44.25,91.1 44.25,91.6 | 44.25,91.6 43.61,91.6 43.61,91.94 | 47.42,88.77 47.42,89.1 U1.50 44.25,89.1 44.25,89.6 U1.51 46.89,89.6 47.27,89.22 v47.42,89.22 | 44.25,88.77 44.25,88.6 U1.49 47.42,88.6 v47.42,87.97 47.88,87.97 | 49.52,77.33 v49.02,77.33 v49.02,77.34 | C17.2 46.24,77.84 v46.36,77.84 | C49.2 43.26,70.28 v43.26,70.71 | C1.2 56.31,85.71 54.77,85.71 | C9.2 63.27,94.29 | C40.2 18.14,73.25 18.21,73.33 | U4.2 18.21,73.33 | 18.21,73.33 18.21,73.25 v18.28,73.31 | C39.2 19.07,77.17 U4.4 18.25,77.07 v18.21,77.1 | 45.1,103.26 P2.5 45.1,108.03 45.52,108.45 | P2.50 22.6,106.3 22.8,106.5 | U1.84 34.61,97.87 34.61,99.26 34.8,99.46 34.8,101.76 | C29.2 34.8,101.76 | 34.8,101.76 34.8,102.6 v34.5,102.9 | VR1.P$1 57.3,78.89 56.56,78.89 v55.38,80.06 | D2.K 67.21,94.38 P3.P$10
  Top 0.4: C45.2 47.88,87.97
  Bottom 0.254: v15.68,96 13.77,94.09 13.77,80.64 v14.12,80.29 | v68.85,114 68.85,114.17 69.02,114.17 | 28.06,100.35 28.06,100.19 28.38,100.19 | 42.8,12 43.09,12.29 SELECT.P$1 | 62.57,42.27 62.8,42.5 | 52.81,42.77 52.33,43.25 | 55.75,34.39 55.96,34.19 | 44.41,34.39 44.39,34.38 | v42.59,6.22 42.41,6.4 42.41,7.1 41.8,7.71 | 41.8,7.75 41.8,7.71 | 41.8,7.71 41.72,7.79 40.01,7.79 39.8,8 | 4.61,44.06 4.8,44.25 | v29.06,11.69 29.12,11.75 31.3,11.75 31.56,12.01 START.P$1 | v34.78,16.83 34.78,19.02 34.55,19.25 | P3.P$10 67.22,93.35 66.45,92.58 | 67.22,86.18 P3.P$7 | 33.41,12.71 v33.61,12.51 | A.P$2 7.36,34.63 v7.34,34.61 | B.P$1 18.28,31.82 21.3,31.82 21.3,30.85 | RIGHT.P$1 46.46,34.33 49.3,34.33 | v49.41,32.7 49.3,32.81 | DOWN.P$2 54.15,29.4 52.9,29.4 52.8,29.5 | UP.P$1 54.25,48.25 54.25,45.3 | LEFT.P$2 65.3,34.3 | P1.32 58.31,56.4 58.4,56.31 58.4,55.3 | 58.7,56.36 58.7,55.35 | 58.55,56.36 58.55,55.35 | 57.8,56.41 57.8,55.4 | 57.65,56.41 57.65,55.4 | 57.5,56.41 57.5,55.4
  Bottom 0.3: 67.22,86.18 66.45,86.95 66.45,92.58
  Bottom 0.504: 49.3,34.33 49.3,32.81 | 54.25,45.3 52.8,45.3
  Bottom 0.508: 65.3,34.3 65.3,33 | 52.85,29.4 54.15,29.4 | 54.55,33.1 54.55,34.4 | 54.6,34.65 53.3,34.65 | 54.55,42.2 54.55,40.9
  other vias: 52.21,105.63 53.27,85.86 62.41,94.96 29.28,0.97 29.81,5.57 22.07,10.41 24.57,10.41 27.83,3.04 34.31,5.98 37,3.74 59.77,24.65 43.66,38.6 59.31,50.31 36.48,9.4 24.91,12.48 24.5,13.43 22.02,19.88 24.74,24.38 12.26,22.65 12.26,25.82 12.26,28.36 9.72,32.17 11.97,33.95 15.37,29.97 22.95,29.97 18.69,29.97 14.42,37.47 16.32,36.41 12.2,38.64 17.74,40.31 20.03,40.24 20.03,44.16 20.03,47.09 15.83,47.09 11.71,46.43 13.81,42.35 7.44,50.25 4.52,48.6 4.56,55.59 4.56,51.78 2.66,46.7 8.4,43.94 2.66,40.98 2.66,34.63 6.24,28.92 8.54,26.49 34.09,51.38 38.66,51.38 46.19,51.35 52.16,51.35 0.75,55.59 0.75,57.97 0.75,61.94 2.82,57.97 5.67,59.24 0.75,65.98 8.85,62.41 12.02,65.59 15.83,69.4 0.75,71.06 0.75,76.14 0.75,81.22 0.75,85.55 0.75,93.13 0.75,96.46 0.75,102.54 0.75,114.01 12.66,70.03 8.85,73.84 6.94,78.29 7.19,82.87 6.8,86.04 5.14,88.4 5.14,90.3 5.14,93.32 3.49,98.45 2.97,103.05 8.93,111.55 14.09,112.1 14.09,114.01 5.2,114.01 9.64,114.01 8.85,108.21 10.83,110.36 14.01,110.36 12.1,106.55 11.47,104 9.56,105.91 15.28,106.55 14.64,102.73 17.18,105.28 14.64,104.64 7.42,105.43 7.71,98.7 9.96,100.71 8.01,96.11 10.83,98.69 12.42,100.27 11.71,101.7 9.56,103.37 22.03,79 24.57,79 24.09,77.89 13.08,80.29 13.52,77.75 14.31,76.95 5.83,71.56 5.83,65.98 8.37,68.52 38.85,47.57 43.93,47.57 48.38,47.57 51.85,46.05 52.59,44.75 55.48,40.67 57.64,52.38 52.03,63.21 53.93,61.3 55.84,59.4 55.84,63.21 59.65,63.21 62.38,87.02 59.65,58.63 59.65,54.76 51.84,43.39 41.37,44.64 47.27,95.83 54.99,95.73 53.35,95.73 50.41,95.73 47.47,91.38 48.82,94.92 62.41,93.21 44.25,89.64 44.25,88.53 44.25,90.75 44.25,91.86 26.39,93.29 30.2,93.29 34.01,93.29 37.82,93.29 41.63,93.29 26.39,89.48 26.39,85.67 30.2,89.48 34.01,89.48 37.82,89.48 41.63,89.48 34.96,84.88 42.9,85.67 43.61,83.29 39.33,86.62 32.34,86.86 28.3,85.75 26.31,83.21 34.09,85.99 35.99,85.99 24.8,98.61 22.18,99.08 20.52,99.64 17.9,99.32 20.04,101.54 26.62,101.54 23.85,101.54 31.07,107.26 27.26,107.26 23.45,107.26 34.88,107.26 38.69,107.26 42.5,107.26 46.31,107.26 48.12,106.16 45.58,103.5 21.79,105.67 19.25,105.67 17.98,109.48 16.09,113.15 42.98,99.32 44.88,97.5 47.95,97.37 46.8,99.25 49,104.33 56.43,107.53 56.02,112.4 55.12,113.34 52.4,110.32 53.43,106.96 51.16,110.36 49.65,113.37 44.57,113.37 39.49,113.37 34.41,113.37 29.33,113.37 24.25,113.37 19.17,113.37 43.32,101.67 57.58,114.01 59.28,112.4 61.63,112.4 60.76,114.01 67.37,113.01 57.35,104.54 57.65,60.67 16.32,34.2 0.75,112.1 5.2,112.1 68.85,112.09 47.47,93.38 55.27,85.86 54.77,90.36 50.27,90.36 35.81,13.26 61.19,43.5 61.92,48.3 61.91,79.29 61.91,67.29 61.91,64.29 61.9,60.67 34.6,47.57 37.62,44.64 50.95,44.79 46.2,44.64 41.37,40.89 61.89,32.55 61.89,26.55 61.73,22.05 52.57,32.66 52.32,26.82 37,0.71 57.29,22.05 52.48,22.05 47.38,16.6 68.73,7.3 68.73,1.3 63.48,1.3 65.98,1.3 65.98,4.3 68.73,4.3 47.97,10.1 55,8.47 51.88,6.97 56.66,8.44 44.49,5.97 34.81,14.76 24.79,19.74 47.97,7.85 51.66,30.45 47.38,14.6 27.44,24.36 28.41,23.4 29.16,22.65 30.38,21.43 61.91,81.79 39.82,7.77 38.47,9.07 61.62,46.8 46.13,16.6 46.13,14.6 9.19,48.5 61.92,52.05 61.92,56.55 56.06,50.56 62.38,85.02 62.38,83.02 54.23,34.17 54.23,39.17 59.98,34.17 56.23,39.17 58.98,38.42 59.98,35.42 57.23,34.17 61.89,29.55 46.59,41.89 51.59,41.89 54.77,24.65 7.75,102.54 36.31,12.51 22.02,18.63 25.99,22.63 23.32,10.41 54.47,10.22 50.84,10.1 26.04,21.11 28,10.5 53.02,104.44 51.83,103.19 56.04,104.61 57.22,10.22 58.97,9.97
  pour Top (isolate 0.254, rank 6): -10.99,120.52 80.44,120.52 80.44,-3.31 -10.99,-3.31
  pour Bottom (isolate 0.254, rank 6): -10.99,120.52 80.44,120.52 80.44,-3.31 -10.99,-3.31
  pour Top (isolate 0.254, rank 2): 17.58,79.88 17.58,76.06 20.12,76.06 21.39,77.33 23.93,77.33 25.84,79.24 19.33,79.24 18.69,79.88
HP_SWITCH  (via drill 0.33)
  Top 0.254: U3.3 45.25,70.81 v45.27,70.79 | v56.42,58.56 56.12,58.56 56.09,58.58 55.48,58.58 55.11,58.21 4.17,58.21 2.4,56.44 2.4,49.82 0.5,47.91 0.5,33.68 3.99,30.19 3.99,27.69 3.55,27.25 3.55,21.12 3.85,20.82 19.63,20.82 20.12,20.33 20.12,7.08 v20.84,6.36 | 32.7,6.13 EM4.1 | EM4.1 32.48,6.34 29.92,6.34 28.78,7.49 v28.76,7.49 | EM4.1 34.58,7.52 C51.1 35.74,7.52 37.43,9.21 R36.1
  Bottom 0.254: v45.27,70.79 45.32,70.74 45.32,69.7 46.89,68.12 46.89,67.12 55.43,58.58 56.09,58.58 56.12,58.56 v56.42,58.56 | v28.76,7.49 28.51,7.24 21.85,7.24 20.97,6.36 v20.84,6.36
LDB1
  Top 0.254: U1.87 33.11,97.87 33.07,97.91 33.07,99.3 33.03,99.34 33.03,102.44 34.1,103.51 P2.27
LDB2
  Top 0.254: P2.28 33.6,103.66 32.57,102.62 32.57,97.87 U1.88
LDB3
  Top 0.254: P2.29 33.08,104.84 33.08,103.78 32.07,102.77 32.07,97.87 U1.89
LDB4
  Top 0.254: P2.30 32.58,104.84 32.58,103.93 31.57,102.91 31.57,97.87 U1.90
LDB5
  Top 0.254: P2.31 32.08,104.84 32.08,104.08 31.07,103.06 31.07,97.87 U1.91
LDG1
  Top 0.254: U1.79 37.09,98.53 P2.21
LDG2
  Top 0.254: 36.61,98.31 36.59,98.29 U1.80 36.59,98.67 36.63,98.72 36.63,104.11 36.6,104.14 P2.22
LDG3
  Top 0.254: U1.81 36.09,98.79 36.17,98.88 36.17,99.5 | 36.17,99.5 36.17,99.53 | 36.17,99.5 36.17,103.97 36.1,104.04 P2.23
LDG4
  Top 0.254: U1.82 35.59,98.95 35.71,99.08 35.71,103.78 35.6,103.89 P2.24
LDG5
  Top 0.254: U1.83 35.09,99.1 35.26,99.27 35.26,103.59 35.12,103.73 35.12,104.84 P2.25
LDR1
  Top 0.254: U1.73 40.09,104.85 P2.15
LDR2
  Top 0.254: P2.16 39.6,97.87 U1.74
LDR3
  Top 0.254: U1.75 39.09,104.85 P2.17
LDR4
  Top 0.254: P2.18 38.6,97.87 U1.76
LDR5
  Top 0.254: U1.77 38.09,104.85 P2.19
LIN_AMP
  Top 0.254: R30.1 51.87,75.98 50.52,74.63 48.82,74.63 R31.2 47.3,74.38 46.74,73.82 U3.1
LP
  Top 0.254: P2.35 30.1,97.87 U1.93
MA0  (via drill 0.33)
  Top 0.254: U2.17 18.02,95.56 18.55,96.08 19.59,96.08 20.09,95.58 v20.75,95.58 | v26.57,95.78 27.09,96.3 U1.99
  Bottom 0.254: v20.75,95.58 23.93,95.58 24.15,95.36 26.15,95.36 v26.57,95.78
MA1  (via drill 0.33)
  Top 0.254: U2.16 18.57,95.35 18.85,95.62 19.4,95.62 v20.12,94.91 | v27.41,95.5 27.59,95.67 U1.98
  Bottom 0.254: v27.41,95.5 26.82,94.91 23.96,94.91 23.75,95.11 21.24,95.11 21.03,94.91 v20.12,94.91
MA2  (via drill 0.33)
  Top 0.254: U2.15 19.52,94.23 v20.78,94.23 | v28.38,95.88 28.09,96.17 U1.97
  Bottom 0.254: v20.78,94.23 21.04,94.23 21.42,94.61 23.6,94.61 23.77,94.45 27.45,94.45 28.38,95.37 v28.38,95.88
MA3
  Top 0.254: U2.14 19.12,83.96 20.77,85.6 U1.124
MA4
  Top 0.254: U1.123 20.62,86.1 18.57,84.06 U2.13
MA5
  Top 0.254: U2.12 18.02,84.15 20.47,86.6 U1.122
MA6
  Top 0.254: U1.121 23.82,87.08 20.31,87.08 17.47,84.25 U2.11
MA7
  Top 0.254: U2.10 16.92,84.34 20.18,87.6 U1.120
MA8
  Top 0.254: U2.4 13.62,84.28 19.45,90.1 U1.115
MA9
  Top 0.254: U1.114 19.3,90.6 13.07,84.37 U2.3
MA10
  Top 0.254: U1.111 18.21,92.1 12.85,92.1 11.97,92.97 U2.28
MA11
  Top 0.254: U2.2 12.52,84.47 19.16,91.1 U1.113
MA12
  Top 0.254: U1.119 20.03,88.1 16.37,84.44 U2.9
MD0  (via drill 0.33)
  Top 0.254: U2.18 17.47,95.66 18.36,96.54 20.09,96.54 v20.27,96.35 | v25.68,96.04 25.87,96.04 26.59,96.75 U1.100
  Bottom 0.254: v20.27,96.35 20.37,96.25 24.21,96.25 24.64,95.82 25.46,95.82 v25.68,96.04
MD1  (via drill 0.33)
  Top 0.254: v20.96,96.92 20.65,96.92 20.55,97.03 18.2,97.03 16.92,95.75 U2.19 | v24.97,96.71 25.22,96.71 25.31,96.8 25.87,96.8 26.09,97.01 U1.101
  Bottom 0.254: v20.96,96.92 21.05,96.84 24.84,96.84 v24.97,96.71
MD2  (via drill 0.33)
  Top 0.254: U2.20 16.37,95.85 18.01,97.48 20.26,97.48 v20.47,97.7 | v24.74,97.61 24.98,97.85 U1.102
  Bottom 0.254: v20.47,97.7 20.57,97.6 21.23,97.6 21.34,97.5 24.62,97.5 v24.74,97.61
MD3  (via drill 0.33)
  Top 0.254: U2.22 15.27,95.45 15,95.72 15,96.28 16.42,97.7 v17.27,97.7 | U1.103 22.94,96.1 22.54,96.5 22.54,97.66 | 22.54,97.66 22.54,97.87 | v22.55,98.18 22.55,97.66 22.54,97.66
  Bottom 0.254: v17.27,97.7 17.4,97.83 19.65,97.83 20.19,98.37 20.75,98.37 20.95,98.18 v22.55,98.18
MD4  (via drill 0.33)
  Top 0.254: U2.23 14.72,95.36 14.54,95.54 14.54,96.47 16.5,98.43 v16.7,98.43 | U1.104 22.62,95.6 22.09,96.13 22.09,97.68 21.23,98.54 v21.23,98.85
  Bottom 0.254: v16.7,98.43 16.89,98.43 16.98,98.52 19.57,98.52 19.88,98.83 21.21,98.83 v21.23,98.85
MD5
  Top 0.254: U2.24 14.17,95.26 14.09,95.35 14.09,96.82 16.37,99.1 16.95,99.1 16.98,99.1 18.14,97.94 19.76,97.94 20.19,98.37 20.75,98.37 21.63,97.49 21.63,95.76 22.28,95.11 23.82,95.11 U1.105
MD6
  Top 0.254: U2.25 13.62,93.71 13.77,93.56 21.06,93.56 22.09,94.58 23.82,94.58 U1.106
MD7
  Top 0.254: U1.109 13.39,93.1 13.07,93.42 U2.26
N$1
  Top 0.254: FB1.5 61.45,90.67 | 61.45,90.67 RA3.4 | C7.1 61.45,92.47 61.45,90.67
N$2
  Top 0.254: FB1.6 RA3.3 60.73,89.78 60.25,89.78 60.02,90.02 60.02,91.69 C6.1
N$3
  Top 0.254: R9.2 62.1,101.45 63,100.55 64.3,100.55 D2.A
N$4
  Top 0.254: R30.2 C52.2
N$5
  Top 0.254: C53.2 R32.2
N$6
  Top 0.254: FB1.7 RA3.2 60.73,89.02 60.25,89.02 59.98,88.75 59.98,87.43 59.24,86.69 C5.1
N$7
  Top 0.254: C52.1 54.26,76.06 55.04,76.06 55.7,75.41 VR1.P$3
N$8
  Top 0.254: R27.1 28.09,78.23 U1.6
N$9
  Top 0.254: FB1.8 61.4,88.12 | 61.4,88.12 RA3.1 | 61.4,88.12 61.4,86.94 C4.1
N$10
  Top 0.254: C53.1 54.12,79.79 56.53,77.38 VR1.P$2
N$11  (via drill 0.35)
  Top 0.254: SW1.P$3 61.83,109.16 | 62.18,105.48 R1.1
  Top 0.508: SW1.P$3 62.28,108.61 v61.42,107.75 | v61.4,104.69 62.18,105.48
  Bottom 0.254: v61.42,107.75 61.92,107.25 61.92,105.22 v61.4,104.69
N$12
  pour Top (isolate 0.25, rank 5): 52.05,16.97 52.05,14.16 55.24,14.16 55.24,16.97
N$13
  pour Top (isolate 0.25, rank 5): 56.92,16.97 56.92,14.16 59.99,14.16 59.99,16.97
N$15  (via drill 0.33, 0.35)
  Top 0.457: 54.3,108.9 53.92,109.28 SW1.P$1 | 55.75,108.9 v55.95,108.7 v55.95,109.6
  Bottom 0.457: v55.95,108.7 57.3,110.05 63.7,110.05 63.7,103.1 64.1,102.7 68.84,102.7
  other vias: 66.8,79.6 65.3,80.56 66.3,80.56 65.8,79.6 65.3,78.56 66.3,78.56 55.95,110.55
  pour Top: 54.17,109.62 55.35,110.8 56.25,110.8 56.25,108.42 55.38,108.42
  pour Bottom: 55.4,111.5 55.4,108.4 62.45,108.4 62.45,100.97 69.4,100.97 69.4,103.1 64.05,103.1 64.05,111.5
  pour Top (isolate 0.254, rank 3): 64.7,8.26 70.05,8.26 70.05,80.82 64.7,80.82
  pour Top (isolate 0.25, rank 5): 62.3,15.25 68.05,15.25 68.05,8.5 67.8,8.25 62.3,8.25
  pour Bottom: 65.15,78.35 67.3,78.35 67.3,80.8 65.8,80.8 65.8,95.75 67.3,95.75 67.3,98 69.8,98 69.8,103.1 64.35,103.1 64.35,94.55 63.4,93.6 63.4,80.1
N$16
  pour Top (isolate 0.25, rank 4): 60.55,17.91 60.55,15.28 65.3,15.28 65.3,17.91
N$17
  pour Top (isolate 0.25, rank 3): 59.8,14.78 59.8,9.62 61.89,9.62 61.89,14.78
N$18  (via drill 0.33)
  Top 0.254: RA3.6 58.64,89.8 57.63,88.79 57.63,85.57 56.7,84.64 54.29,84.64 53.97,84.32 v53.97,83.78 | v44.31,84.7 44.41,84.6 U1.41
  Bottom 0.254: v44.31,84.7 44.5,84.51 48.67,84.51 50.09,83.08 53.27,83.08 v53.97,83.78
N$19
  Top 0.254: R10.2 60.02,103.57 59.06,102.61 59.06,100.7 Q1.3 | R10.2 60.41,103.71 | R10.2 62.04,103.71 R9.1
N$20
  pour Top (isolate 0.25, rank 4): 54.55,13.66 59.42,13.66 59.42,11 54.55,11
N$23
  Top 0.254: C20.1 C13.1 4.47,102.19 5.8,103.51 5.8,108 6.71,108.91 8.11,108.91 10.44,111.24 BRIGHTNESS.TP
N$24
  Top 0.254: P3.GND 67.08,87.64 67.07,87.78 65.67,86.38 64.43,86.38 64.12,86.69 EM9.1
N$25  (via drill 0.33)
  Top 0.254: v6.51,105.72 6.51,101.71 C14.1 C15.1 | v6.51,109.69 6.51,110.47 PALETTE.TP
  Bottom 0.254: v6.51,105.72 v6.51,109.69
N$29
  Top 0.254: U3.7 44.75,68.58 44.54,68.36 42.08,68.36 C49.1
N$35
  Top 0.254: EM4.2 34.98,9.62 P5.SW
N$40  (via drill 0.33)
  Top 0.254: C27.2 8.98,21.28 19.82,21.28 20.58,20.52 20.58,7.63 v20.89,7.32 | v28.51,8.37 28.51,8.62 30.28,10.39 R22.1 30.36,10.88 33.2,10.88 P5.R
  Bottom 0.254: v20.89,7.32 21.27,7.69 28.02,7.69 28.51,8.19 v28.51,8.37
N$41
  Top 0.254: 23.13,11.59 C26.2 23.3,11.42 25.15,11.42 P5.L 26.38,10.1 R23.1
N$42
  Top 0.254: C26.1 24.12,7.8 EM2.2
N$43
  Top 0.254: EM3.2 4.75,22.71 C27.1
N$44
  Top 0.254: C21.1 21.92,13.99 21.05,13.12 21.05,8.11 21.57,7.59 21.57,4.71 SPK+.TP
P00  (via drill 0.33)
  Top 0.254: U1.1 25.59,81.02 25.39,80.83 25.39,79.36 v25.82,78.93 | v15.54,48.27 15.75,48.48 50.64,48.48 53.55,45.57 53.55,42.6 v52.8,41.85
  Bottom 0.254: v25.82,78.93 26.04,78.72 26.04,77.69 25.45,77.1 25.45,75.08 7.13,56.76 7.13,51.58 11.3,47.41 14.68,47.41 v15.54,48.27 | RIGHT.P$2 52.45,40.4 52.8,40.75 v52.8,41.85
P01  (via drill 0.33)
  Top 0.254: U1.4 27.11,81.83 27.11,80.99 27.41,80.68 v27.41,79.99 | v13.77,48.76 14.41,49.4 51.04,49.4 58.66,41.78 v58.66,40.77
  Bottom 0.254: v27.41,79.99 27.41,77.12 26.82,76.53 26.82,74.51 8.5,56.19 8.5,52.2 11.27,49.43 13.1,49.43 v13.77,48.76 | LEFT.P$1 68.3,40.4 62.31,40.4 61.73,39.83 59.52,39.83 58.66,40.69 v58.66,40.77
P02  (via drill 0.33)
  Top 0.254: U1.3 26.57,81.83 26.57,80.58 v26.65,80.49 | v12.82,48.76 13.94,49.88 51.3,49.88 59.3,41.87 59.3,41.85 v60.55,40.6
  Bottom 0.254: v26.65,80.49 26.74,80.4 26.74,79.71 26.96,79.5 26.96,77.31 26.36,76.72 26.36,74.7 8.04,56.38 8.04,52.01 11.29,48.76 v12.82,48.76 | UP.P$2 60.29,40.86 v60.55,40.6
P03  (via drill 0.33)
  Top 0.254: 26.07,81.83 U1.2 26.09,80.88 25.98,80.77 25.98,80.21 26.07,80.13 v26.07,79.82 | v14.41,48.09 15.26,48.94 50.85,48.94 57.94,41.85 57.94,41.29 v57.29,40.64
  Bottom 0.254: v26.07,79.82 26.28,79.6 26.28,79.53 26.5,79.31 26.5,77.5 25.91,76.91 25.91,74.89 7.58,56.57 7.58,51.77 11.27,48.09 v14.41,48.09 | v57.29,40.64 58.56,39.37 60.3,39.37 60.9,38.77 60.9,32.9 60.27,32.28 60.27,26.38 DOWN.P$1
P10  (via drill 0.33)
  Top 0.254: U1.125 20.91,85.1 19.8,83.98 v19.8,83.68 | OSD_A.TP 10.47,106.56 12.66,104.37 v12.66,101.37
  Bottom 0.254: v12.66,101.37 12.66,101.31 13.31,100.66 13.78,100.66 15.11,99.32 15.11,97.61 17.36,95.37 17.36,91.31 20.01,88.66 20.01,83.89 v19.8,83.68 19.8,72.01 5.3,57.52 5.3,49.38 10.36,44.32 10.36,42.74 A.P$1
P11  (via drill 0.33)
  Top 0.254: U1.126 21.19,84.6 20.47,83.88 v20.47,83.05 | v12.58,39.72 12.92,39.72 14.18,38.47 16.21,38.47 v16.69,37.98 | OSD_B.TP 13.64,101.39 v13.59,101.33
  Bottom 0.254: v12.58,39.72 12.58,39.84 11.83,40.59 11.83,43.51 5.76,49.59 5.76,57.33 20.25,71.82 20.25,82.83 v20.47,83.05 20.47,88.84 17.81,91.5 17.81,95.56 15.57,97.8 15.57,99.56 13.8,101.33 v13.59,101.33 | B.P$2 16.88,37.79 v16.69,37.98
P12  (via drill 0.33, 0.35)
  Top 0.254: U1.128 22.33,83.6 v22.16,83.43 | v12.98,41.87 13.48,41.37 13.48,40.55 14.65,39.38 22.92,39.38 24.3,38 24.3,29.66 25.05,28.91 v25.05,28.84 | v11.33,102.68 7.29,106.72 OSD_SEL.TP
  Bottom 0.15: SELECT.P$2 37.55,17.49 | 38.05,17.88 38.05,19.38
  Bottom 0.254: v12.98,41.87 12.78,42.07 12.78,43.9 6.67,50.01 6.67,56.95 21.17,71.44 21.17,82.15 21.73,82.71 21.73,83 v22.16,83.43 21.94,83.64 21.94,83.96 20.93,84.98 20.93,89.18 18.27,91.84 18.27,95.75 16.03,97.99 16.03,99.84 13.19,102.68 v11.33,102.68 | v25.05,28.84 26.05,27.84 26.05,24.52 29.87,20.7 36.73,20.7 38.05,19.38 | 37.55,17.5 37.55,17.49 37.66,17.49 38.05,17.88
P13  (via drill 0.33, 0.35)
  Top 0.254: U1.127 21.46,84.1 21.16,83.8 v21.27,83.69 | v12.78,40.87 12.78,40.53 14.39,38.92 22.72,38.92 23.83,37.81 23.83,29.16 v24.14,28.84
  Bottom 0.15: 26.55,19.46 26.55,17.5 | 26.03,17.5 START.P$2
  Bottom 0.254: v21.27,83.69 21.27,82.9 20.71,82.34 20.71,71.63 6.21,57.14 6.21,49.78 12.29,43.7 12.29,41.36 v12.78,40.87 | v24.14,28.84 24.14,28.75 25.58,27.31 25.58,24.33 26.91,23 26.91,19.82 26.55,19.46 | 26.55,17.5 26.03,17.5
PUSH  (via drill 0.33)
  Top 0.254: RST.2 21.26,77.21 20.12,76.06 13.69,76.06 11.49,78.26 11.49,84.83 12.87,86.2 v12.87,89.4 | SW2.T 8.73,89.4 v7.18,89.4
  Bottom 0.254: v7.18,89.4 v12.87,89.4
R4  (via drill 0.33)
  Top 0.254: RA3.7 58.79,89 v58.3,88.51 | U1.96 28.61,97.83 28.61,96.99 29.26,96.33 v29.26,96.26 | v35.36,96.39 35.61,96.64 50.27,96.64 50.88,97.26 52.85,97.26 53.41,96.7 56.81,96.7 v57.11,96.4
  Bottom 0.254: v58.3,88.51 57.35,89.47 57.35,96.16 v57.11,96.4 | v29.26,96.26 29.64,95.88 30.48,95.88 30.98,96.39 v35.36,96.39
RA0
  Top 0.254: U1.116 19.59,89.6 14.17,84.18 U2.5
RA1
  Top 0.254: U2.8 15.82,84.54 19.89,88.6 U1.118
RA1-S01
  Top 0.254: C19.2 RA1A.2
RA1-S02
  Top 0.254: RA1B.2 C18.2
RD  (via drill 0.33)
  Top 0.254: v27.92,83.84 27.92,83.52 28.59,82.85 U1.7
  Bottom 0.254: P1.4 28.62,67.41 28.62,82.81 27.92,83.52 v27.92,83.84
RES  (via drill 0.33)
  Top 0.254: 42.59,80.13 42.59,78.96 R3.2 C17.1 47.54,78.57 U6.1 | 42.59,80.13 U1.35 | v42.43,80.28 42.59,80.13 | v46.4,63.61 28.27,63.61 21.84,70.04 v21.84,72.42 | v21.84,76.06 22.79,77.01 RST.1
  Top 0.508: P1.30 55.11,50.18 58.44,46.85 C47.1
  Bottom 0.254: v42.43,80.28 42.13,80.28 40.51,78.66 40.51,69.5 v46.4,63.61 P1.30 | v21.84,72.42 21.62,72.64 21.62,75.85 v21.84,76.06
RIN_AMP
  Top 0.254: R33.2 44.17,73.74 U3.5 44.27,73.84 44.27,74.83 44.77,75.33 50.38,75.33 50.99,75.94 50.99,78.91 R32.1
ROCK_DOWN
  Top 0.254: C14.2 6.64,95.38 8.87,93.15 SW2.2
ROCK_UP
  Top 0.254: C13.2 6,98.49 6,88.78 7.98,86.8 SW2.1
ROUT  (via drill 0.33)
  Top 0.254: U3.6 44.25,70.98 43.2,72.04 R33.1 42.22,71.31 v41.64,70.73 | v55.78,57.91 55.59,57.72 4.33,57.72 2.86,56.25 2.86,49.63 0.96,47.73 0.96,33.87 4.5,30.33 4.5,27.2 4.75,26.94 EM3.1
  Bottom 0.254: v41.64,70.73 44.01,68.36 46.01,68.36 46.44,67.94 46.44,66.93 55.45,57.91 v55.78,57.91
S01  (via drill 0.33)
  Top 0.254: U1.37 43.59,80.92 45.01,79.49 49.97,79.49 50.32,79.14 v50.32,77.46 | v50.35,73.02 50.35,71.75 51.15,70.95 C19.1
  Bottom 0.254: v50.32,77.46 50.47,77.31 50.47,74.65 50.19,74.36 50.19,73.17 v50.35,73.02
S02  (via drill 0.33)
  Top 0.254: C18.1 51.87,74.14 51.75,74.02 v50.86,74.02 | v50.58,79.83 50.46,79.95 45.2,79.95 44.09,81.07 U1.38
  Bottom 0.254: v50.58,79.83 50.58,78.15 50.99,77.75 50.99,74.14 v50.86,74.02
SCK  (via drill 0.33)
  Top 0.254: RA3.8 58.87,88.12 58.12,87.37 58.12,85.41 57.69,84.99 57.67,84.97 | 57.67,84.97 R26.1 57.67,84.14 | 45.85,84.11 U1.40 44.85,84.1 v44.56,83.81 | 57.67,84.97 56.89,84.19 54.87,84.19 v54.87,83.97
  Bottom 0.254: v54.87,83.97 54.87,83.73 53.74,82.61 49.92,82.61 48.52,84.01 44.77,84.01 v44.56,83.81
SOUT  (via drill 0.33)
  Top 0.254: U1.42 44.93,85.1 v44.41,85.62 | RA3.5 58.86,90.67 57.58,89.4 57.58,89.39 57.17,88.98 57.17,85.79 56.48,85.1 53.79,85.1 v53.67,84.97
  Bottom 0.254: v44.41,85.62 45.05,84.98 48.84,84.98 50.28,83.54 52.75,83.54 53.67,84.45 v53.67,84.97
SPK+  (via drill 0.33)
  Top 0.254: U3.8 45.27,69.4 45.27,68.25 45.24,68.25 v44.69,67.69 | v56.29,56.39 55.94,56.74 4.66,56.74 3.77,55.85 3.77,49.25 1.87,47.35 1.87,34.25 5.41,30.71 5.41,28.42 12.1,21.73 20.01,21.73 21.14,20.6 21.14,17.6 21.94,16.79 C21.2
  Bottom 0.254: v44.69,67.69 44.69,67.39 55.68,56.39 v56.29,56.39
SPK-  (via drill 0.33)
  Top 0.254: R31.1 47.68,71.78 v47.42,71.78 | v47.42,69.33 47.34,69.42 U3.10 46.25,68.22 v45.68,67.66 | EM2.1 21.59,2.38 SPK-.TP | v56.47,57.29 56.41,57.24 4.49,57.24 3.32,56.06 3.32,49.44 1.41,47.54 1.41,34.06 4.95,30.52 4.95,28.23 9.82,23.36 9.82,22.11 v9.79,22.07
  Bottom 0.254: v47.42,71.78 v47.42,69.33 | v45.68,67.66 45.68,67.03 55.51,57.21 56.39,57.21 v56.47,57.29 | v9.79,22.07 11.04,20.82 19.63,20.82 20.12,20.33 20.12,3.04 21.41,1.75 SPK-.TP
SPL
  Top 0.254: U1.71 41.09,104.85 P2.13
SPS
  Top 0.254: P2.6 44.58,104.84 44.58,104.03 42.09,101.53 U1.69
SW  (via drill 0.33, 0.35)
  Top 0.254: R4.2 54.35,106.66 57.56,106.66 58.26,107.36 58.26,109.58 SW1.P$C 58.28,111.16 58.38,111.25 55.47,114.17 15.13,114.17 v15.04,114.08 | BATT.TP 15.17,109.08 v15.04,109.08
  Top 0.457: 63.32,22.65 63.32,82.3 64.27,83.25 68.71,83.25 69.04,83.58 69.04,101.25 68.02,102.27 63.87,102.27 63.87,110.81 63.43,111.25 58.3,111.25 58.3,109.63 SW1.P$C | 57.78,108.89 SW1.P$C | 57.78,109.02 SW1.P$C
  Bottom 0.254: v15.04,114.08 v15.04,109.08 | SW.TP 58.99,107.56 v60.36,107.56
  other vias: 68.91,82.11 68.91,83.26 68.01,97.21 68.96,97.21 68.01,96.06 68.96,96.06 67.81,82.11 67.81,83.26 66.66,82.11 66.66,83.26
  pour Top (isolate 0.25, rank 2): 57.3,106.62 57.3,111.5 64.05,111.5 64.05,103.09 70.05,103.09 70.05,81.31 64.21,81.31 64.21,21.09 67.05,18.25 67.05,11.09 64.92,11.09 64.92,17.88 62.71,20.09 62.71,81.81 64.64,83.75 68.02,83.75 68.02,95 67.55,95 67.55,101.04 62.96,101.04 62.96,106.62
  pour Bottom (rank 2): 65.85,81.3 69.65,81.3 69.65,97.5 67.75,97.5 67.75,84.2 65.85,84.2
SW1B  (via drill 0.35)
  Top 0.254: 21.39,25.45 28.83,25.45 43.82,10.45 43.9,9.78 P4.3
  Top 0.4: 42.74,9.53 42.38,9.06 43.65,7.78 P4.3
  Top 0.508: 21.26,25.32 21.39,25.45 | 42.74,9.53 42.74,10.62
  Bottom 0.254: 16.61,28.34 v16.3,28.65
  other vias: 13.55,28.15 19.05,28.15 13.55,22.65 19.05,22.65 14.85,28.65 17.75,28.65 19.55,26.15
  pour Top (isolate 0.254): 13.14,29.07 13.14,22.24 21.1,22.25 24.02,25.17 27.83,25.17 30.76,22.24 30.77,22.24 43.49,9.52 43.49,7.74 45.52,7.74 45.52,12.54 28.99,29.07
  pour Top (isolate 0.25): 42.26,11 42.26,9.05 44.3,9.05 44.3,11
  pour Bottom: 13.15,29.1 13.15,22.25 19.8,22.25 19.8,29.1
VIN  (via drill 0.33)
  Top 0.254: v43.36,80.2 43.36,80.5 43.11,80.75 43.11,81.83 U1.36
  Bottom 0.254: P1.31 56.61,54.81 40.97,70.46 40.97,78.47 41.97,79.48 42.64,79.48 v43.36,80.2
VR1-S01
  Top 0.254: RA1A.1 54.37,71.22 57.83,71.22 57.83,71.4 VR1.P$5
VR1-S02
  Top 0.254: RA1B.1 54.93,74.38 55.86,73.44 VR1.P$4
WR  (via drill 0.33)
  Top 0.254: v27.95,74.8 28.12,74.97 R27.2
  Bottom 0.254: P1.3 14.61,54.81 28.17,68.36 28.17,74.58 v27.95,74.8

## Text on the board
tPlace: P3 | SW2 | 256K / SRAM | SW2 | VR1 / 10K×2 | P1 | VR1 | 32 | 2 | 4 | 6 | 8 | 10 | 12 | 14 | 16 | 18 | 20 | 22 | 24 | 26 | 28 | 30 | 1 | 3 | 5 | 7 | 9 | 11 | 13 | 15 | 17 | 19 | 21 | 23 | 25 | 27 | 29 | 31 | C10 | C47 | BT+ | BT- | EM3 | C27 | + | BT+ | EM7 | EM6 | + | F1 | DC | EM8 | F2 | C21 | R22 | P5 | R36 | + | C26 | DC | P4 | 7 | 1 | + | 2 | 3 | 6 | 2 | 1 | R23 | 5 | 3 | EM2 | EM4 | 2 | 3 | EM10 | 4 | U5 | C51 | D1 | 1 | 4
bPlace: UP | A | RIGHT | LEFT | B | DOWN | START | SELECT
tNames: UP | DOWN | A | B | SEL | BAT | * | REV A, B, C, D | 3.3V | 2023 | MouseBiteLabs | -01 | MGBC-MBL
tStop: v2.1
bStop: MGBC-MBL-01